# EAGLE design opl3_module (EAGLE 4.16)
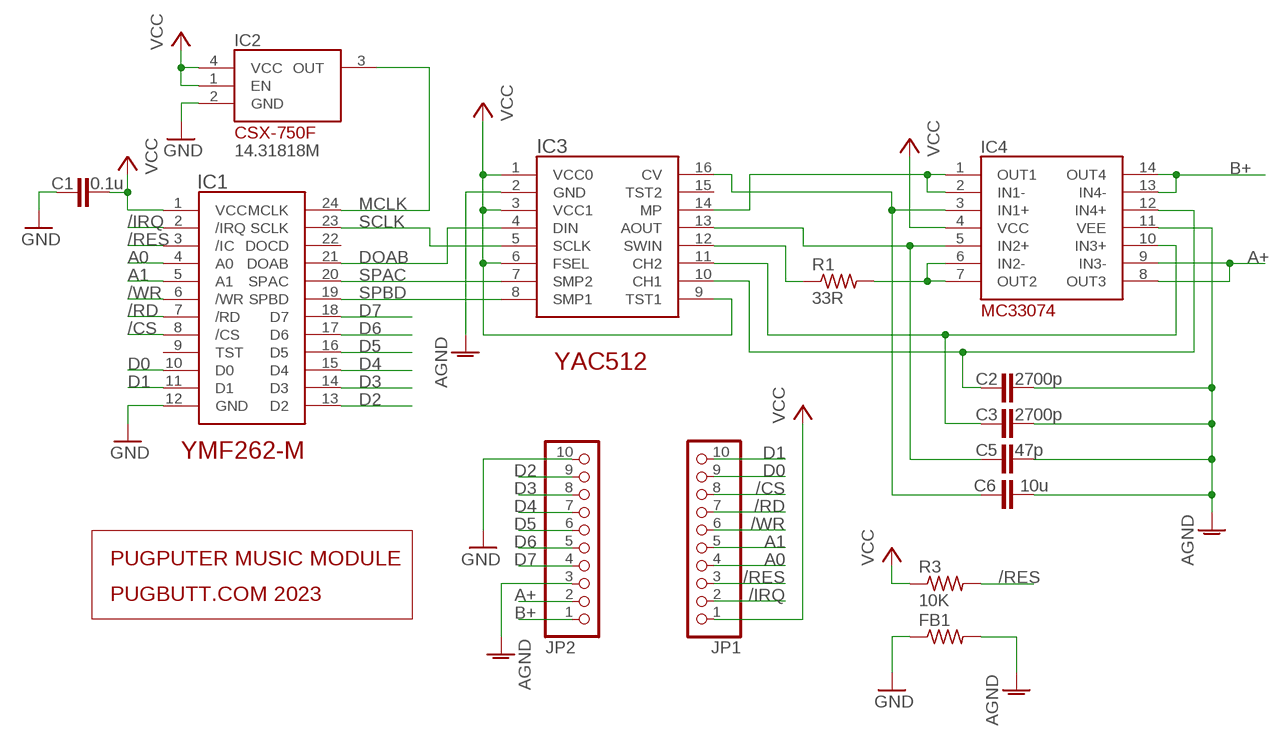
[diagram p0: schematic, sheet 1]

## Parts
C1  0.1u  C-EUC0603  [C0603]
C2  2700p  C-EUC0603  [C0603]
C3  2700p  C-EUC0603  [C0603]
C5  47p  C-EUC0603  [C0603]
C6  10u  C-EUC0805  [C0805]
FB1  R-US_R0603  [R0603]
IC1  YMF262-M  YMF262  [YMF262_SOP24]
IC2  14.31818M  OSC_CSX-750F  [XTAL_CSX-750F]
IC3  YAC512  [YAC512]
IC4  MC33074  [SOIC14]
JP1  PINHD-1X10  [1X10]
JP2  PINHD-1X10  [1X10]
R1  33R  R-US_R0603  [R0603]
R3  10K  R-US_R0603  [R0603]

## Nets
/CS: IC1.8(/CS) JP1.8
/IRQ: IC1.2(/IRQ) JP1.2
/RD: IC1.7(/RD) JP1.7
/RES: IC1.3(/IC) JP1.3 R3.2
/WR: IC1.6(/WR) JP1.6
A0: IC1.4(A0) JP1.4
A1: IC1.5(A1) JP1.5
A+: IC4.8(OUT3) IC4.9(IN3-) JP2.2
AGND [agnd]: C2.2 C3.2 C5.2 C6.2 FB1.2 IC3.2(GND) IC4.11(VEE) JP2.3
B+: IC4.13(IN4-) IC4.14(OUT4) JP2.1
D0: IC1.10(D0) JP1.9
D1: IC1.11(D1) JP1.10
D2: IC1.13(D2) JP2.9
D3: IC1.14(D3) JP2.8
D4: IC1.15(D4) JP2.7
D5: IC1.16(D5) JP2.6
D6: IC1.17(D6) JP2.5
D7: IC1.18(D7) JP2.4
DOAB: IC1.21(DOAB) IC3.4(DIN)
GND [agnd]: C1.1 FB1.1 IC1.12(GND) IC2.2(GND) JP2.10
MCLK: IC1.24(MCLK) IC2.3(OUT)
N$3: C6.1 IC3.16(CV) IC4.3(IN1+)
N$7: IC3.12(SWIN) R1.1
N$8: C3.1 IC3.11(CH2) IC4.10(IN3+)
N$9: C2.1 IC3.10(CH1) IC4.12(IN4+)
N$10: C5.1 IC3.13(AOUT) IC4.5(IN2+)
O1: IC3.14(MP) IC4.1(OUT1) IC4.2(IN1-)
O2: IC4.6(IN2-) IC4.7(OUT2) R1.2
SCLK: IC1.23(SCLK) IC3.5(SCLK)
SPAC: IC1.20(SPAC) IC3.7(SMP2)
SPBD: IC1.19(SPBD) IC3.8(SMP1)
VCC [supply]: C1.2 IC1.1(VCC) IC2.1(EN) IC2.4(VCC) IC3.1(VCC0) IC3.3(VCC1) IC3.6(FSEL) IC3.9(TST1) IC4.4(VCC) JP1.1 R3.1
Unconnected: IC1.9(TST) IC1.22(DOCD) IC3.15(TST2)

## Notes on the sheet
- YAC512
- YMF262-M
- PUGPUTER MUSIC MODULE
- PUGBUTT.COM 2023

## Library data of the parts
C1-C3 C5 C6 = rcl:C-EU: CAPACITOR, European symbol
FB1 R1 R3 = rcl:R-US_: RESISTOR, American symbol
IC1 = 07-Retrocomputing:YMF262
IC2 = 07-Retrocomputing:OSC_CSX-750F
IC3 = 07-Retrocomputing:YAC512
IC4 = 07-Retrocomputing:MC33074
JP1 JP2 = pinhead:PINHD-1X10: PIN HEADER

## Net classes
0 default: width 0.203 mm, drill 0.203 mm, clearance 0.254 mm
1 supply: width 0.61 mm, drill 0.203 mm, clearance 0.305 mm
2 agnd: width 0.406 mm, drill 0.203 mm, clearance 0.305 mm

## Board
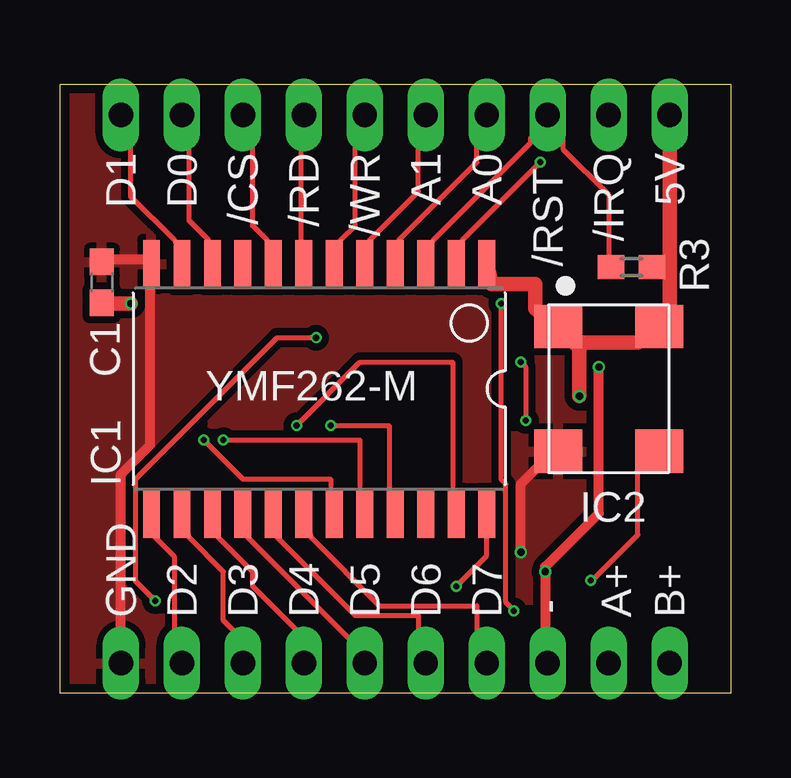
[diagram p1: board, top side]
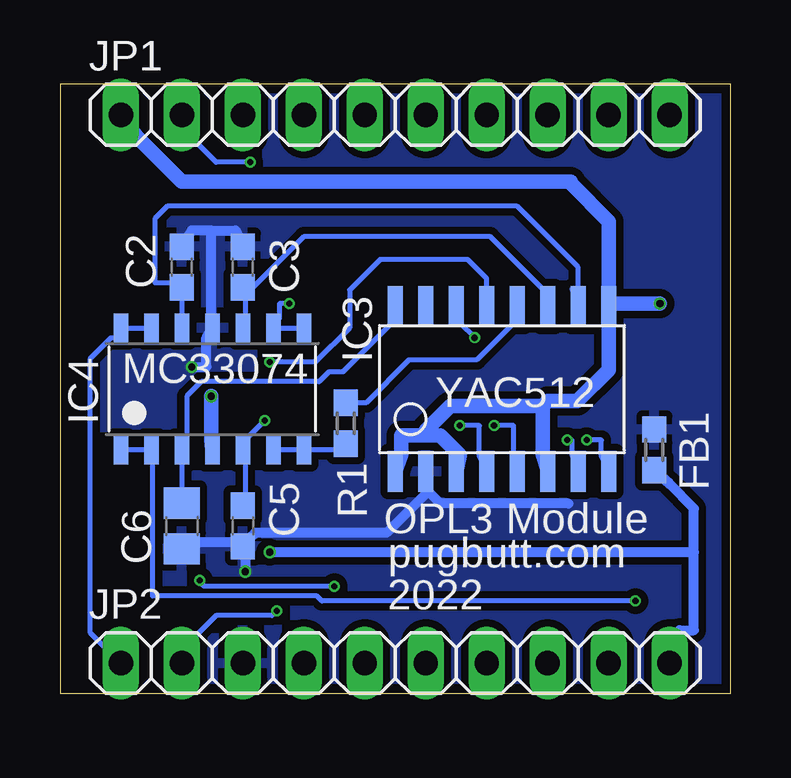
[diagram p2: board, bottom side, seen from below]

Size 27.94 x 25.4 mm. Coordinates in mm from the lower left corner, seen from the top.
Outline: 0,0 0,25.4 27.94,25.4 27.94,0 0,0
Copper layers (1*2*15*16): Top 0.0356mm / dielectric 0.1702mm / Route2 0.0178mm / dielectric 1.1938mm / Route15 0.0178mm / dielectric 0.1702mm / Bottom 0.0356mm
Design rules "oshpark-4layer": minimum track width 5mil, minimum drill 10mil, track to track 5mil, track to pad 5mil, pad to pad 5mil, via to via 5mil, smd to smd 5mil, copper to edge 15mil, drill to drill 6mil, minimum pad ring 4mil, minimum via ring 4mil, stop-mask expansion 2.5mil, vias tented up to drill 0mil, thermal gap 10mil

### Footprints (pad centres in the part's own frame; a part is rotated, then mirrored left to right if it is on the bottom)
C0603 = smd 1.1 x 1: 1 -0.85,0; 2 0.85,0
C0805 = smd 1.3 x 1.5: 1 -0.95,0; 2 0.95,0
R0603 = smd 1.1 x 1: 1 -0.85,0; 2 0.85,0
YMF262_SOP24 = smd 2 x 0.7: 1 -5.215,6.985; 2 -5.215,5.715; 3 -5.215,4.445; 4 -5.215,3.175; 5 -5.215,1.905; 6 -5.215,0.635; 7 -5.215,-0.635; 8 -5.215,-1.905; 9 -5.215,-3.175; 10 -5.215,-4.445; 11 -5.215,-5.715; 12 -5.215,-6.985; 13 5.215,-6.985; 14 5.215,-5.715; 15 5.215,-4.445; 16 5.215,-3.175; 17 5.215,-1.905; 18 5.215,-0.635; 19 5.215,0.635; 20 5.215,1.905; 21 5.215,3.175; 22 5.215,4.445; 23 5.215,5.715; 24 5.215,6.985
XTAL_CSX-750F = smd 1.8 x 2: 1 -2.6,-2.1; 2 2.6,-2.1; 3 2.6,2.1; 4 -2.6,2.1
YAC512 = smd 1.7 x 0.635: 1 -3.435,4.445; 2 -3.435,3.175; 3 -3.435,1.905; 4 -3.435,0.635; 5 -3.435,-0.635; 6 -3.435,-1.905; 7 -3.435,-3.175; 8 -3.435,-4.445; 9 3.435,-4.445; 10 3.435,-3.175; 11 3.435,-1.905; 12 3.435,-0.635; 13 3.435,0.635; 14 3.435,1.905; 15 3.435,3.175; 16 3.435,4.445
SOIC14 = smd 1.2 x 0.6: 1 -2.54,3.81; 2 -2.54,2.54; 3 -2.54,1.27; 4 -2.54,0; 5 -2.54,-1.27; 6 -2.54,-2.54; 7 -2.54,-3.81; 8 2.54,-3.81; 9 2.54,-2.54; 10 2.54,-1.27; 11 2.54,0; 12 2.54,1.27; 13 2.54,2.54; 14 2.54,3.81
1X10 = drill 1.016 long: 1 -11.43,0; 2 -8.89,0; 3 -6.35,0; 4 -3.81,0; 5 -1.27,0; 6 1.27,0; 7 3.81,0; 8 6.35,0; 9 8.89,0; 10 11.43,0

### Placement (x,y rotation side)
C1  1.75,17.14 270 top
C2  22.86,17.78 90 bottom
C3  20.32,17.78 90 bottom
C5  20.32,6.99 270 bottom
C6  22.86,6.99 270 bottom
FB1  3.17,10.16 90 bottom
IC1  10.79,12.7 270 top
IC2  22.86,12.7 270 top
IC3  9.53,12.7 90 bottom
IC4  21.59,12.7 90 bottom
JP1  13.97,24.13 0 bottom
JP2  13.97,1.27 0 bottom
R1  16.03,11.27 270 bottom
R3  23.81,17.78 180 top

### Tracks (layer width: path | path; a pad name or v marks a point on that pad's centre or on a via)
/CS
  Top 0.203: IC1.8 8.64,18.9 8.03,19.51 8.03,22.76 JP1.8
/IRQ  (via drill 0.25)
  Top 0.203: v20.02,22.15 16.76,18.9 IC1.2
  Bottom 0.203: v20.02,22.15 21.44,22.15 22.25,22.96 JP1.2
/RD
  Top 0.203: IC1.7 10.06,18.9 10.06,22.76 JP1.7
/RES
  Top 0.203: IC1.3 15.54,18.9 19.61,22.96 19.61,23.16 JP1.3 20.95,23.5 20.95,22.7 22.86,20.8 22.86,17.78 R3.2
/WR
  Top 0.203: IC1.6 11.68,18.9 12.29,19.51 12.29,22.76 JP1.6
A0
  Top 0.203: IC1.4 14.12,18.9 17.37,22.15 17.37,22.76 JP1.4
A1
  Top 0.203: IC1.5 12.9,18.9 14.94,20.93 14.94,22.76 JP1.5
A+  (via drill 0.25)
  Top 0.203: v18.39,16.26 18.39,8.91 18.57,8.73 18.57,3.81 18.91,3.47 v18.91,3.45
  Bottom 0.203: IC4.8 IC4.9 18.8,15.65 18.8,16.26 v18.39,16.26 | v18.91,3.45 19.11,3.25 21.44,3.25 22.25,2.44 JP2.2
AGND  (via drill 0.3)
  Top 0.406: JP2.3 20.22,2.64 v20.22,5.08 20.22,5.28 22.45,7.52 v22.45,13.61
  Bottom 0.406: 21.64,19.3 20.62,19.3 C3.2 | 21.64,19.3 22.45,19.3 C2.2 | 21.64,19.3 21.64,15.65 IC4.11 21.84,14.83 21.84,13.61 v22.45,13.61 | C5.2 20.62,6.3 22.25,6.3 C6.2 | 6.76,7.92 12.09,7.92 12.6,8.43 | 12.6,8.43 12.7,8.53 IC3.2 | C5.2 20.02,6.5 19.81,6.71 14.33,6.71 12.6,8.43 | v20.22,5.08 20.22,5.69 C5.2
  pour Bottom: 27.94,25.4 27.94,0 0,0 0,25.4
B+
  Bottom 0.203: IC4.13 IC4.14 25.5,14.83 25.81,14.83 26.67,13.97 26.67,2.54 JP2.1
D0
  Top 0.203: IC1.10 6.2,18.9 5.38,19.71 5.38,22.76 JP1.9
D1
  Top 0.203: IC1.11 4.78,18.9 2.95,20.73 2.95,22.76 JP1.10
D2
  Top 0.203: IC1.13 3.96,6.5 4.78,5.69 4.78,2.64 JP2.9
D3
  Top 0.203: IC1.14 5.38,6.5 6.81,5.08 6.81,3.05 7.21,2.64 JP2.8
D4
  Top 0.203: IC1.15 6.6,6.5 8.03,5.08 8.03,4.47 9.86,2.64 JP2.7
D5
  Top 0.203: IC1.16 7.82,6.5 12.09,2.23 JP2.6
D6
  Top 0.203: IC1.17 9.04,6.5 12.29,3.25 14.94,3.25 14.94,2.64 JP2.5
D7
  Top 0.203: IC1.18 10.46,6.5 13.31,3.66 17.37,3.66 17.37,2.64 JP2.4
DOAB  (via drill 0.25)
  Top 0.203: v11.28,11.18 13.72,11.18 13.72,8.33 IC1.21
  Bottom 0.203: v11.28,11.18 10.46,11.18 10.46,9.96 IC3.4
GND  (via drill 0.3)
  Top 0.406: C1.1 1.73,18.09 3.56,18.09 IC1.12 3.76,17.07 3.76,10.36 2.54,9.14 JP2.10 | v19.2,5.89 19.2,8.74 19.81,9.35 IC2.2
  Bottom 0.406: 1.52,5.89 1.52,2.64 2.13,2.64 JP2.10 | 1.52,5.89 v19.2,5.89 | FB1.1 2.54,8.73 1.52,7.71 1.52,5.89
  pour Top: 27.94,25.4 27.94,0 0,0 0,25.4
MCLK  (via drill 0.25)
  Top 0.203: IC2.3 24.08,9.35 24.08,6.62 22.18,4.72 v22.11,4.72 | v16.51,4.47 17.78,5.74 IC1.24
  Bottom 0.203: v22.11,4.72 22.11,4.65 21.93,4.47 v16.51,4.47
N$3
  Bottom 0.203: C6.1 IC4.3 22.66,10.57 22.66,12.39 22.05,13.01 17.14,13.01 16.73,13.41 16.15,13.41 14.12,15.44 IC3.16
N$7
  Bottom 0.203: IC3.12 9.04,15.44 10.58,13.91 13.4,13.91 15.18,12.12 R1.1
N$8
  Bottom 0.203: IC4.10 20.22,15.65 20.22,17.07 C3.1 20.32,16.51 17.78,19.05 10.01,19.05 7.82,16.87 IC3.11
N$9
  Bottom 0.203: IC4.12 C2.1 23.27,17.13 23.99,17.13 23.99,19.8 23.47,20.32 8.89,20.32 6.35,17.78 IC3.10 6.6,16.87
N$10  (via drill 0.25)
  Top 0.203: v19.2,13.82 19.41,13.61 v19.41,11.38
  Bottom 0.203: C5.1 20.22,8.33 20.22,9.75 IC4.5 20.22,10.57 v19.41,11.38 | v19.2,13.82 17.3,13.82 15.88,15.24 15.88,16.83 14.61,18.1 10.95,18.1 10.16,17.3 IC3.13
O1  (via drill 0.25)
  Top 0.203: v3.96,3.86 3.15,4.67 3.15,8.94 9.04,14.83 v10.67,14.83
  Bottom 0.203: IC4.1 IC4.2 24.08,9.75 24.08,4.06 17.23,4.06 17.03,3.86 v3.96,3.86 | v10.67,14.83 11.28,15.44 IC3.14
O2
  Bottom 0.203: IC4.6 IC4.7 16.19,10.16 16.03,10.32 | 16.03,10.32 | R1.2 16.03,10.32
SCLK  (via drill 0.25)
  Top 0.203: v9.86,11.18 12.5,13.82 16.36,13.82 16.36,8.33 IC1.23
  Bottom 0.203: v9.86,11.18 9.04,11.18 9.04,9.96 IC3.5
SPAC  (via drill 0.25)
  Top 0.203: v6.81,10.57 12.5,10.57 12.5,8.33 IC1.20
  Bottom 0.203: v6.81,10.57 6.6,10.57 6.6,9.96 IC3.7
SPBD  (via drill 0.25)
  Top 0.203: v5.99,10.57 7.62,8.94 11.28,8.94 11.28,8.33 IC1.19
  Bottom 0.203: v5.99,10.57 5.38,10.57 5.38,9.96 IC3.8
VCC  (via drill 0.3)
  Top 0.61: v2.95,16.26 1.73,16.26 C1.2 | 21.64,14.43 v21.64,12.39 | 21.64,14.43 IC2.1 19.81,16.05 19.81,17.07 17.98,17.07 IC1.1 | 21.64,14.43 21.84,14.63 24.08,14.63 IC2.4 25.02,15.24 25.4,15.24 25.4,17.78 | JP1.1 25.4,17.78 | 25.4,17.78 R3.1
  Bottom 0.61: v2.95,16.26 4.78,16.26 IC3.9 | 12.7,10.77 12.09,10.77 11.28,9.96 IC3.3 | 12.7,10.77 13.72,10.77 13.72,9.96 IC3.1 | 7.82,11.99 7.82,9.96 IC3.6 | 7.82,11.99 11.68,11.99 12.7,10.97 12.7,10.77 | 7.82,11.99 7.62,12.19 6.38,12.19 5.08,13.49 IC3.9 | v21.64,12.39 21.64,10.57 IC4.4 | JP1.1 24.69,23.16 22.86,21.34 6.66,21.34 6.66,21.29 6.67,21.27 5.08,19.68 IC3.9

### Text on the board
tNames: D1 | D0 | /CS | /RD | /WR | A1 | A0 | /IRQ | 5V | /RST | GND | D2 | D3 | D4 | D5 | D6 | D7 | - | A+ | B+
bNames: OPL3 Module | pugbutt.com | 2022